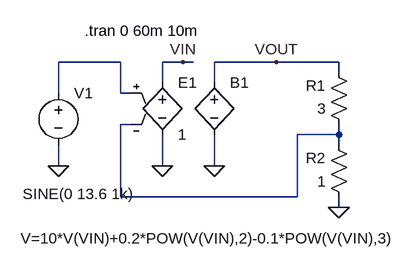
[diagram p0: schematic fig-02-05-30.asc]
fig-02-05-30.asc, the LTspice schematic file:
Version 4
SHEET 1 880 680
WIRE 208 64 112 64
WIRE 304 64 272 64
WIRE 320 64 304 64
WIRE 448 64 352 64
WIRE 544 64 448 64
WIRE 544 80 544 64
WIRE 272 96 272 64
WIRE 352 96 352 64
WIRE 112 112 112 64
WIRE 208 112 208 64
WIRE 224 112 208 112
WIRE 224 160 208 160
WIRE 544 176 544 160
WIRE 544 176 480 176
WIRE 544 192 544 176
WIRE 112 224 112 192
WIRE 272 224 272 176
WIRE 352 224 352 176
WIRE 208 272 208 160
WIRE 480 272 480 176
WIRE 480 272 208 272
WIRE 544 288 544 272
FLAG 112 224 0
FLAG 352 224 0
FLAG 448 64 VOUT
FLAG 304 64 VIN
FLAG 272 224 0
FLAG 544 288 0
SYMBOL voltage 112 96 R0
WINDOW 123 0 0 Left 0
WINDOW 39 0 0 Left 0
WINDOW 3 -55 171 Left 2
SYMATTR Value SINE(0 13.6 1k)
SYMATTR InstName V1
SYMBOL bv 352 80 R0
WINDOW 3 -298 256 Left 2
SYMATTR Value V=10*V(VIN)+0.2*POW(V(VIN),2)-0.1*POW(V(VIN),3)
SYMATTR InstName B1
SYMBOL e 272 80 R0
SYMATTR InstName E1
SYMATTR Value 1
SYMBOL res 560 176 R180
WINDOW 0 36 76 Left 2
WINDOW 3 36 40 Left 2
SYMATTR InstName R1
SYMATTR Value 3
SYMBOL res 560 288 R180
WINDOW 0 36 76 Left 2
WINDOW 3 36 40 Left 2
SYMATTR InstName R2
SYMATTR Value 1
TEXT 152 16 Left 2 !.tran 0 60m 10m

The netlist it stands for:
* fig-02-05-30.asc
V1 N001 0 SINE(0 13.6 1k)
B1 VOUT 0 V=10*V(VIN)+0.2*POW(V(VIN),2)-0.1*POW(V(VIN),3)
E1 VIN 0 N001 N002 1
R1 N002 VOUT 3
R2 0 N002 1
.tran 0 60m 10m
.backanno
.end